# Altium schematic sheet Step-up converter.SchDoc: Step-up Converter
size A4
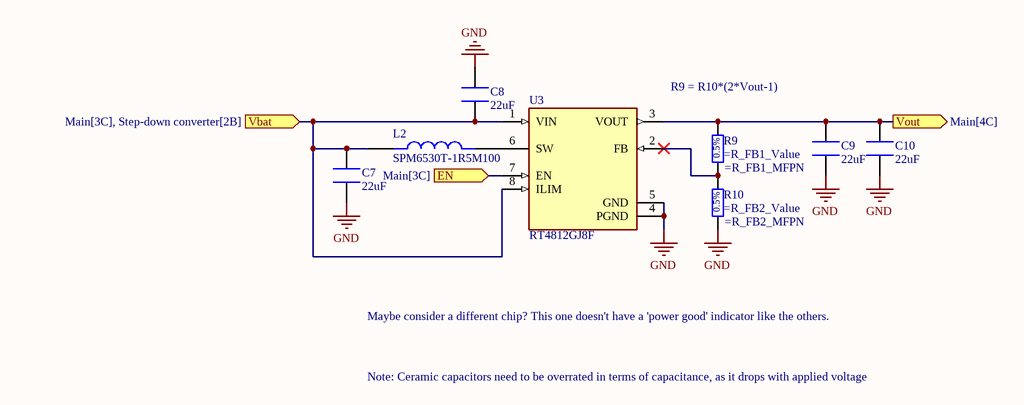
[diagram p0: Step-up converter.SchDoc]

## Parts
C7  22uF  [CAPACITOR_0805_2012M-70N]
C8  22uF  [CAPACITOR_0805_2012M-70N]
C9  22uF  [CAPACITOR_0805_2012M-70N]
C10  22uF  [CAPACITOR_0805_2012M-70N]
L2  SPM6530T-1R5M100  [IND_SPM6530T-1R5M100]
R9  (no value)  [Resistor_0805_2012M-50N]
R10  (no value)  [Resistor_0805_2012M-50N]
U3  RT4812GJ8F  [SOT28-8N-1.45mm]

## Ports
EN (in, see Main[3C]), Vbat (in, see Main[3C], Step-down converter[2B]), Vout (out, see Main[4C])

## Nets
GND: C7.1 C8.1 C9.1 C10.1 R10.1 U3.4(PGND) U3.5(GND)
EN: U3.7(EN) ; port EN
Vbat: C7.2 C8.2 L2.1 U3.1(VIN) U3.8(ILIM) ; port Vbat
Vout: C9.2 C10.2 R9.2 U3.3(VOUT) ; port Vout
NetL2_2: L2.2 U3.6(SW)
NetR9_1: R9.1 R10.2 U3.2(FB)

## Notes on the sheet
- R9 = R10*(2*Vout-1)
- Maybe consider a different chip? This one doesn't have a 'power good' indicator like the others.
- Note: Ceramic capacitors need to be overrated in terms of capacitance, as it drops with applied voltage
- Title:
- Design Name:
- Revision:
- Project:
- Date:
- Designer:
- File:
- Time:
- Document Size:
- A4

## Library data of the parts
C7-C10 = C0805C226M9PACTU: Passive - Capacitor, X5R, 22uF Max, 6.3V, 0805 (2012 Metric), ±20%, -55°C ~ 85°C. 8.8uF @ 5V; APSS Standard Part: APSS Standard; Capacitance at Rated Voltage: 30%; Tolerance: ±20%; Temperature Coefficient: X5R; Rated Voltage: 6.3V; Temp Range: -55°C ~ 85°C; Package: 0805; Supplier 1: Digikey; Supplier 1 Part No.: 399-C0805C226M9PAC7800CT-ND; MF Part No.: C0805C226M9PACTU; Value: 22uF
L2 = SPM6530T-1R5M100: 1.5 uH Shielded Drum Core, Wirewound Inductor 11 A 10.67mOhm Max Nonstandard; MF: TDK; Supplier 1: Digikey; Supplier 1 Part No.: 445-3881-2-ND; MF Part No.: SPM6530T-1R5M100
R9 R10 = RG2012P-xxx-D-T5 Series: Passive - Resistor Series, 0805, 0.5%, 10 - 1M, E24, 0.063W, 1/8W, ±25ppm/°C, -55°C ~ 155°C, 0805 (2012 Metric); APSS Standard Part: APSS Standard; Value Range: 10 ~ 1M; Rated Voltage: 150V; Tolerance: 0.5%; Power: 1/8W; E Series: E24; Temp Range: -55°C ~ 155°C; Supplier 1: Digikey; Package: 0805; Temperature Coefficient: ±25ppm/°C
  R9: MF Part No.: =R_FB1_MFPN; Value: =R_FB1_Value
  R10: MF Part No.: =R_FB2_MFPN; Value: =R_FB2_Value
U3 = RT4812GJ8F: Boost Switching Regulator IC Positive Adjustable 1.8V 1 Output 2A SOT-23-8 Thin, TSOT-23-8; APSS Standard Part: APSS Standard; Rated Voltage: 5.5V; Temp Range: -40°C ~ 85°C (TA); Package: SOT-28-8; MF Part No.: RT4812GJ8F; Supplier 1: Digikey; Supplier 1 Part No.: 1028-1512-1-ND